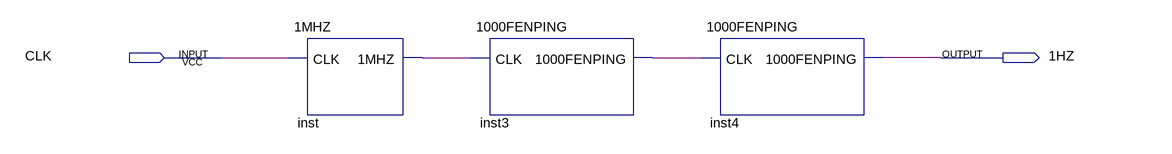
[diagram p0: schematic sheet]
// Quartus schematic 1HZ.bdf as structural Verilog: 3 symbols, 2 pins
module \1HZ  (
  input  CLK,
  output \1HZ 
);

  wire inst3_1000fenping, inst_1mhz;

  \1MHZ  inst (.CLK(CLK), .\1MHZ (inst_1mhz));
  \1000FENPING  inst3 (.CLK(inst_1mhz), .\1000FENPING (inst3_1000fenping));
  \1000FENPING  inst4 (.CLK(inst3_1000fenping), .\1000FENPING (\1HZ ));
endmodule
